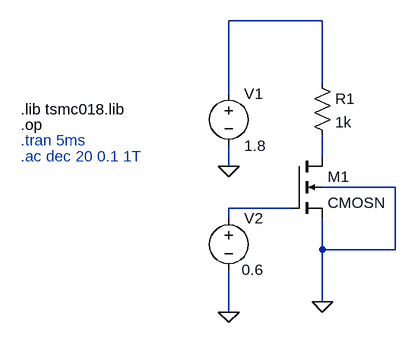
[diagram p0: schematic Experiment-1.asc]
Experiment-1.asc, the LTspice schematic file:
Version 4
SHEET 1 880 680
WIRE -160 -112 -304 -112
WIRE -160 -16 -160 -112
WIRE -304 0 -304 -112
WIRE -160 96 -160 64
WIRE -304 112 -304 80
WIRE -48 144 -160 144
WIRE -208 176 -304 176
WIRE -304 192 -304 176
WIRE -160 240 -160 192
WIRE -48 240 -48 144
WIRE -48 240 -160 240
WIRE -160 320 -160 240
WIRE -304 336 -304 272
FLAG -160 320 0
FLAG -304 112 0
FLAG -304 336 0
SYMBOL nmos4 -208 96 R0
SYMATTR InstName M1
SYMATTR Value CMOSN
SYMATTR Value2 l=180n w=1.12u
SYMBOL voltage -304 -16 R0
WINDOW 123 0 0 Left 0
WINDOW 39 0 0 Left 0
SYMATTR InstName V1
SYMATTR Value 1.8
SYMBOL voltage -304 176 R0
WINDOW 123 11 106 Left 2
WINDOW 39 0 0 Left 0
WINDOW 3 20 95 Left 2
SYMATTR Value 0.6
SYMATTR InstName V2
SYMBOL res -176 -32 R0
SYMATTR InstName R1
SYMATTR Value 1k
TEXT -624 24 Left 2 !.lib tsmc018.lib
TEXT -624 48 Left 2 !.op
TEXT -624 96 Left 2 ;.ac dec 20 0.1 1T
TEXT -624 72 Left 2 ;.tran 5ms

The netlist it stands for:
* Experiment-1.asc
M1 N002 N003 0 0 CMOSN l=180n w=1.12u
V1 N001 0 1.8
V2 N003 0 0.6
R1 N001 N002 1k
.model NMOS NMOS
.model PMOS PMOS
.lib standard.mos
.lib tsmc018.lib
.op
* .ac dec 20 0.1 1T
* .tran 5ms
.backanno
.end